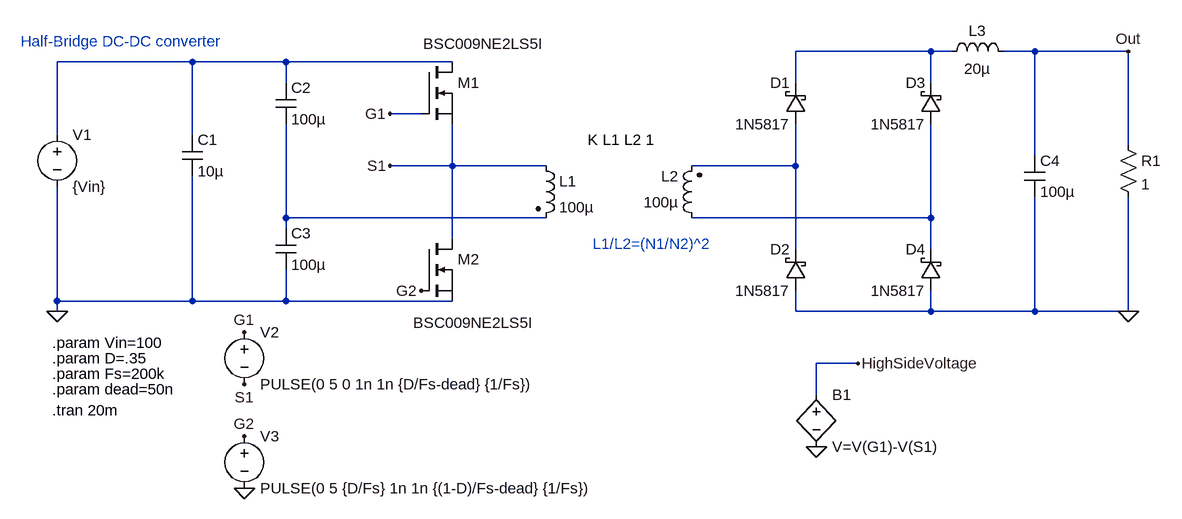
[diagram p0: schematic Half-Bridge Converter.asc]
Half-Bridge Converter.asc, the LTspice schematic file:
Version 4
SHEET 1 1680 724
WIRE 1248 0 1040 0
WIRE 1280 0 1248 0
WIRE 1408 0 1360 0
WIRE 1552 0 1408 0
WIRE 112 16 -96 16
WIRE 256 16 112 16
WIRE 512 16 256 16
WIRE 256 48 256 16
WIRE 1040 48 1040 0
WIRE 1248 48 1248 0
WIRE 464 96 416 96
WIRE -96 128 -96 16
WIRE 112 128 112 16
WIRE 1552 144 1552 0
WIRE 1408 160 1408 0
WIRE 512 176 512 112
WIRE 512 176 416 176
WIRE 656 176 512 176
WIRE 1040 176 1040 112
WIRE 1040 176 880 176
WIRE 256 256 256 112
WIRE 656 256 256 256
WIRE 1248 256 1248 112
WIRE 1248 256 880 256
WIRE 256 272 256 256
WIRE 512 288 512 176
WIRE 1040 304 1040 176
WIRE 1248 304 1248 256
WIRE -96 384 -96 208
WIRE 112 384 112 192
WIRE 112 384 -96 384
WIRE 256 384 256 336
WIRE 256 384 112 384
WIRE 512 384 256 384
WIRE -96 400 -96 384
WIRE 1040 400 1040 368
WIRE 1248 400 1248 368
WIRE 1248 400 1040 400
WIRE 1408 400 1408 224
WIRE 1408 400 1248 400
WIRE 1552 400 1552 224
WIRE 1552 400 1408 400
WIRE 1136 480 1072 480
WIRE 1072 528 1072 480
FLAG -96 400 0
FLAG 416 96 G1
FLAG 416 176 S1
FLAG 464 368 G2
FLAG 192 432 G1
FLAG 192 512 S1
FLAG 192 592 G2
FLAG 192 672 0
FLAG 1552 400 0
FLAG 1072 608 0
FLAG 1136 480 HighSideVoltage
FLAG 1552 0 Out
SYMBOL voltage -96 112 R0
WINDOW 123 0 0 Left 0
WINDOW 39 0 0 Left 0
SYMATTR InstName V1
SYMATTR Value {Vin}
SYMBOL cap 96 128 R0
SYMATTR InstName C1
SYMATTR Value 10µ
SYMBOL cap 240 48 R0
SYMATTR InstName C2
SYMATTR Value 100µ
SYMBOL cap 240 272 R0
SYMATTR InstName C3
SYMATTR Value 100µ
SYMBOL nmos 464 16 R0
WINDOW 3 3 -28 Left 2
SYMATTR InstName M1
SYMATTR Value BSC009NE2LS5I
SYMBOL ind2 640 160 R0
SYMATTR InstName L1
SYMATTR Value 100µ
SYMATTR Type ind
SYMBOL nmos 464 288 R0
WINDOW 3 -12 129 Left 2
SYMATTR InstName M2
SYMATTR Value BSC009NE2LS5I
SYMBOL voltage 192 416 R0
WINDOW 123 0 0 Left 0
WINDOW 39 0 0 Left 0
SYMATTR InstName V2
SYMATTR Value PULSE(0 5 0 1n 1n {D/Fs-dead} {1/Fs})
SYMBOL voltage 192 576 R0
WINDOW 123 0 0 Left 0
WINDOW 39 0 0 Left 0
SYMATTR InstName V3
SYMATTR Value PULSE(0 5 {D/Fs} 1n 1n {(1-D)/Fs-dead} {1/Fs})
SYMBOL ind2 896 272 R180
WINDOW 0 36 80 Left 2
WINDOW 3 36 40 Left 2
SYMATTR InstName L2
SYMATTR Value 100µ
SYMATTR Type ind
SYMBOL schottky 1056 112 R180
WINDOW 0 24 64 Left 2
WINDOW 3 24 0 Left 2
SYMATTR InstName D1
SYMATTR Value 1N5817
SYMATTR Description Diode
SYMATTR Type diode
SYMBOL schottky 1056 368 R180
WINDOW 0 24 64 Left 2
WINDOW 3 24 0 Left 2
SYMATTR InstName D2
SYMATTR Value 1N5817
SYMATTR Description Diode
SYMATTR Type diode
SYMBOL schottky 1264 112 R180
WINDOW 0 24 64 Left 2
WINDOW 3 24 0 Left 2
SYMATTR InstName D3
SYMATTR Value 1N5817
SYMATTR Description Diode
SYMATTR Type diode
SYMBOL schottky 1264 368 R180
WINDOW 0 24 64 Left 2
WINDOW 3 24 0 Left 2
SYMATTR InstName D4
SYMATTR Value 1N5817
SYMATTR Description Diode
SYMATTR Type diode
SYMBOL cap 1392 160 R0
SYMATTR InstName C4
SYMATTR Value 100µ
SYMBOL ind 1264 16 R270
WINDOW 0 32 56 VTop 2
WINDOW 3 5 56 VBottom 2
SYMATTR InstName L3
SYMATTR Value 20µ
SYMBOL res 1536 128 R0
SYMATTR InstName R1
SYMATTR Value 1
SYMBOL bv 1072 512 R0
SYMATTR InstName B1
SYMATTR Value V=V(G1)-V(S1)
TEXT -152 -16 Left 2 ;Half-Bridge DC-DC converter
TEXT -104 472 Left 2 !.param D=.35
TEXT -104 496 Left 2 !.param Fs=200k
TEXT -104 448 Left 2 !.param Vin=100
TEXT -104 520 Left 2 !.param dead=50n
TEXT 720 136 Left 2 !K L1 L2 1
TEXT 728 296 Left 2 ;L1/L2=(N1/N2)^2
TEXT -104 552 Left 2 !.tran 20m

The netlist it stands for:
* Half-Bridge Converter.asc
V1 N002 0 {Vin}
C1 N002 0 10µ
C2 N002 N004 100µ
C3 N004 0 100µ
M1 N002 G1 S1 S1 BSC009NE2LS5I
L1 S1 N004 100µ
M2 S1 G2 0 0 BSC009NE2LS5I
V2 G1 S1 PULSE(0 5 0 1n 1n {D/Fs-dead} {1/Fs})
V3 G2 0 PULSE(0 5 {D/Fs} 1n 1n {(1-D)/Fs-dead} {1/Fs})
L2 N005 N003 100µ
D1 N003 N001 1N5817
D2 0 N003 1N5817
D3 N005 N001 1N5817
D4 0 N005 1N5817
C4 Out 0 100µ
L3 N001 Out 20µ
R1 Out 0 1
B1 HighSideVoltage 0 V=V(G1)-V(S1)
.model D D
.lib standard.dio
.model NMOS NMOS
.model PMOS PMOS
.lib standard.mos
* Half-Bridge DC-DC converter
.param D=.35
.param Fs=200k
.param Vin=100
.param dead=50n
K L1 L2 1
* L1/L2=(N1/N2)^2
.tran 20m
.backanno
.end